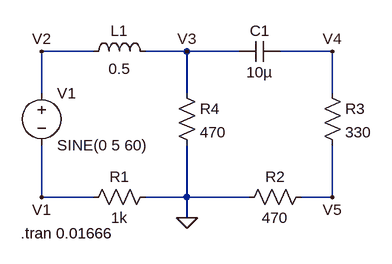
[diagram p0: schematic sim1-ac.asc]
sim1-ac.asc, the LTspice schematic file:
Version 4
SHEET 1 880 680
WIRE 32 96 -48 96
WIRE 176 96 112 96
WIRE 256 96 176 96
WIRE 400 96 320 96
WIRE -48 160 -48 96
WIRE 176 160 176 96
WIRE 400 160 400 96
WIRE -48 320 -48 240
WIRE 32 320 -48 320
WIRE 176 320 176 240
WIRE 176 320 112 320
WIRE 272 320 176 320
WIRE 400 320 400 240
WIRE 400 320 352 320
WIRE 176 352 176 320
FLAG 176 352 0
FLAG 176 96 V3
FLAG 400 96 V4
FLAG -48 96 V2
FLAG -48 320 V1
FLAG 400 320 V5
SYMBOL voltage -48 144 R0
WINDOW 123 0 0 Left 2
WINDOW 39 0 0 Left 2
SYMATTR InstName V1
SYMATTR Value SINE(0 5 60)
SYMBOL ind 16 112 R270
WINDOW 0 32 56 VTop 2
WINDOW 3 5 56 VBottom 2
SYMATTR InstName L1
SYMATTR Value 0.5
SYMBOL res 128 304 R90
WINDOW 0 0 56 VBottom 2
WINDOW 3 32 56 VTop 2
SYMATTR InstName R1
SYMATTR Value 1k
SYMBOL res 160 144 R0
SYMATTR InstName R4
SYMATTR Value 470
SYMBOL res 384 144 R0
SYMATTR InstName R3
SYMATTR Value 330
SYMBOL res 368 304 R90
WINDOW 0 0 56 VBottom 2
WINDOW 3 32 56 VTop 2
SYMATTR InstName R2
SYMATTR Value 470
SYMBOL cap 320 80 R90
WINDOW 0 0 32 VBottom 2
WINDOW 3 32 32 VTop 2
SYMATTR InstName C1
SYMATTR Value 10µ
TEXT -80 376 Left 2 !.tran 0.01666

The netlist it stands for:
* sim1-ac.asc
V1 V2 V1 SINE(0 5 60)
L1 V2 V3 0.5
R1 0 V1 1k
R4 V3 0 470
R3 V4 V5 330
R2 V5 0 470
C1 V4 V3 10µ
.tran 0.01666
.backanno
.end